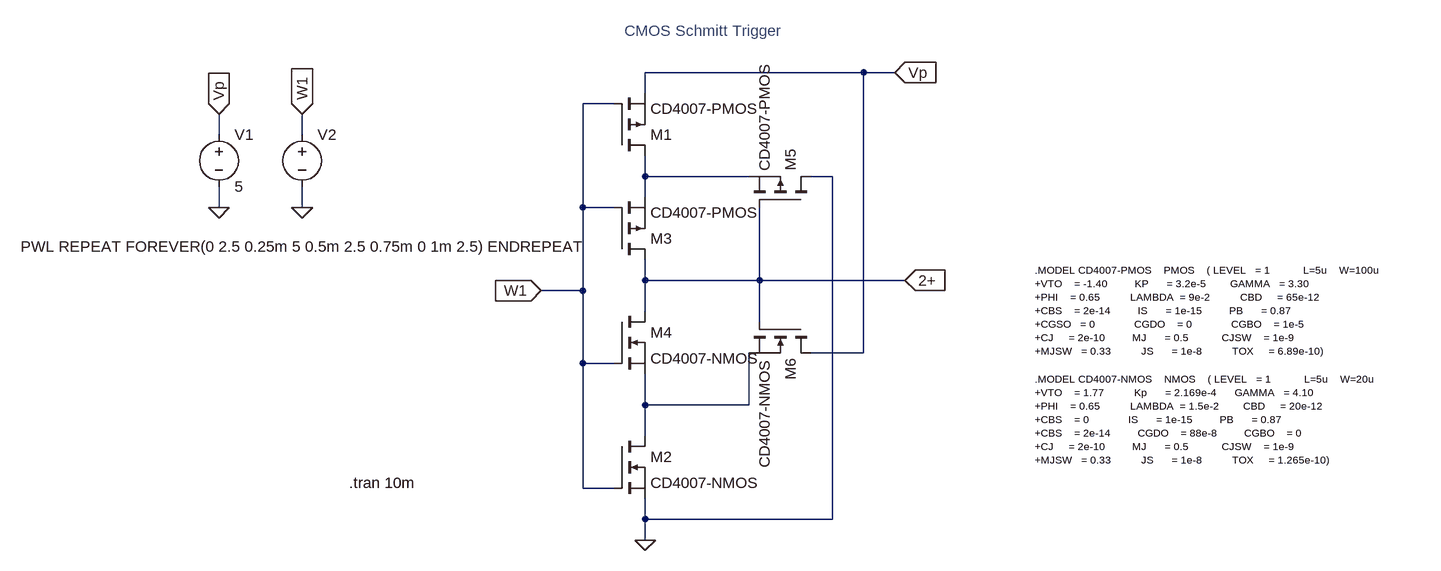
[diagram p0: schematic cmos_schmitt_trig_ltspice.asc]
cmos_schmitt_trig_ltspice.asc, the LTspice schematic file:
Version 4
SHEET 1 1416 680
WIRE 240 -416 -96 -416
WIRE 288 -416 240 -416
WIRE -96 -384 -96 -416
WIRE -144 -368 -192 -368
WIRE -752 -320 -752 -352
WIRE -624 -320 -624 -352
WIRE -96 -256 -96 -288
WIRE 64 -256 -96 -256
WIRE 192 -256 160 -256
WIRE -96 -224 -96 -256
WIRE -752 -208 -752 -240
WIRE -624 -208 -624 -240
WIRE -192 -208 -192 -368
WIRE -144 -208 -192 -208
WIRE -96 -96 -96 -128
WIRE 80 -96 80 -208
WIRE 80 -96 -96 -96
WIRE 304 -96 80 -96
WIRE -192 -80 -192 -208
WIRE -192 -80 -256 -80
WIRE -96 -48 -96 -96
WIRE 80 -32 80 -96
WIRE 240 16 240 -416
WIRE 240 16 160 16
WIRE -192 32 -192 -80
WIRE -144 32 -192 32
WIRE -96 96 -96 48
WIRE 64 96 64 16
WIRE 64 96 -96 96
WIRE -96 144 -96 96
WIRE -192 224 -192 32
WIRE -144 224 -192 224
WIRE -96 272 -96 240
WIRE 192 272 192 -256
WIRE 192 272 -96 272
WIRE -96 304 -96 272
FLAG -256 -80 W1
IOPIN -256 -80 In
FLAG -752 -208 0
FLAG -624 -208 0
FLAG -752 -352 Vp
IOPIN -752 -352 In
FLAG -624 -352 W1
IOPIN -624 -352 In
FLAG 288 -416 Vp
IOPIN 288 -416 In
FLAG 304 -96 2+
IOPIN 304 -96 In
FLAG -96 304 0
SYMBOL voltage -752 -336 R0
WINDOW 123 0 0 Left 0
WINDOW 39 0 0 Left 0
SYMATTR InstName V1
SYMATTR Value 5
SYMBOL voltage -624 -336 R0
WINDOW 3 -433 188 Left 2
WINDOW 123 0 0 Left 0
WINDOW 39 0 0 Left 0
SYMATTR InstName V2
SYMATTR Value PWL REPEAT FOREVER(0 2.5 0.25m 5 0.5m 2.5 0.75m 0 1m 2.5) ENDREPEAT
SYMBOL pmos -144 -288 M180
SYMATTR InstName M1
SYMATTR Value CD4007-PMOS
SYMBOL nmos -144 144 R0
SYMATTR InstName M2
SYMATTR Value CD4007-NMOS
SYMBOL pmos -144 -128 M180
SYMATTR InstName M3
SYMATTR Value CD4007-PMOS
SYMBOL nmos -144 -48 R0
SYMATTR InstName M4
SYMATTR Value CD4007-NMOS
SYMBOL pmos 160 -208 M270
SYMATTR InstName M5
SYMATTR Value CD4007-PMOS
SYMBOL nmos 160 -32 R90
SYMATTR InstName M6
SYMATTR Value CD4007-NMOS
TEXT 504 -112 Left 1 !.MODEL CD4007-PMOS    PMOS    ( LEVEL   = 1           L=5u    W=100u                \n+VTO    = -1.40         KP      = 3.2e-5        GAMMA   = 3.30  \n+PHI    = 0.65          LAMBDA  = 9e-2          CBD     = 65e-12\n+CBS    = 2e-14         IS      = 1e-15         PB      = 0.87\n+CGSO   = 0             CGDO    = 0             CGBO    = 1e-5\n+CJ     = 2e-10         MJ      = 0.5           CJSW    = 1e-9\n+MJSW   = 0.33          JS      = 1e-8          TOX     = 6.89e-10)
TEXT 504 56 Left 1 !.MODEL CD4007-NMOS    NMOS    ( LEVEL   = 1           L=5u    W=20u             \n+VTO    = 1.77          Kp      = 2.169e-4      GAMMA   = 4.10  \n+PHI    = 0.65          LAMBDA  = 1.5e-2        CBD     = 20e-12\n+CBS    = 0             IS      = 1e-15         PB      = 0.87\n+CBS    = 2e-14         CGDO    = 88e-8         CGBO    = 0\n+CJ     = 2e-10         MJ      = 0.5           CJSW    = 1e-9\n+MJSW   = 0.33          JS      = 1e-8          TOX     = 1.265e-10)
TEXT -552 216 Left 2 !.tran 10m
TEXT -128 -480 Left 2 ;CMOS Schmitt Trigger

The netlist it stands for:
* cmos_schmitt_trig_ltspice.asc
V1 Vp 0 5
V2 W1 0 PWL REPEAT FOREVER(0 2.5 0.25m 5 0.5m 2.5 0.75m 0 1m 2.5) ENDREPEAT
M1 N001 W1 Vp Vp CD4007-PMOS
M2 N002 W1 0 0 CD4007-NMOS
M3 2+ W1 N001 N001 CD4007-PMOS
M4 2+ W1 N002 N002 CD4007-NMOS
M5 0 2+ N001 N001 CD4007-PMOS
M6 Vp 2+ N002 N002 CD4007-NMOS
.model NMOS NMOS
.model PMOS PMOS
.lib standard.mos
.MODEL CD4007-PMOS    PMOS    ( LEVEL   = 1           L=5u    W=100u
+VTO    = -1.40         KP      = 3.2e-5        GAMMA   = 3.30
+PHI    = 0.65          LAMBDA  = 9e-2          CBD     = 65e-12
+CBS    = 2e-14         IS      = 1e-15         PB      = 0.87
+CGSO   = 0             CGDO    = 0             CGBO    = 1e-5
+CJ     = 2e-10         MJ      = 0.5           CJSW    = 1e-9
+MJSW   = 0.33          JS      = 1e-8          TOX     = 6.89e-10)
.MODEL CD4007-NMOS    NMOS    ( LEVEL   = 1           L=5u    W=20u
+VTO    = 1.77          Kp      = 2.169e-4      GAMMA   = 4.10
+PHI    = 0.65          LAMBDA  = 1.5e-2        CBD     = 20e-12
+CBS    = 0             IS      = 1e-15         PB      = 0.87
+CBS    = 2e-14         CGDO    = 88e-8         CGBO    = 0
+CJ     = 2e-10         MJ      = 0.5           CJSW    = 1e-9
+MJSW   = 0.33          JS      = 1e-8          TOX     = 1.265e-10)
.tran 10m
* CMOS Schmitt Trigger
.backanno
.end